# Altium schematic sheet Main_8.SchDoc
size 199 x 260 mm; SheetNumber: 11; SheetTotal: 12
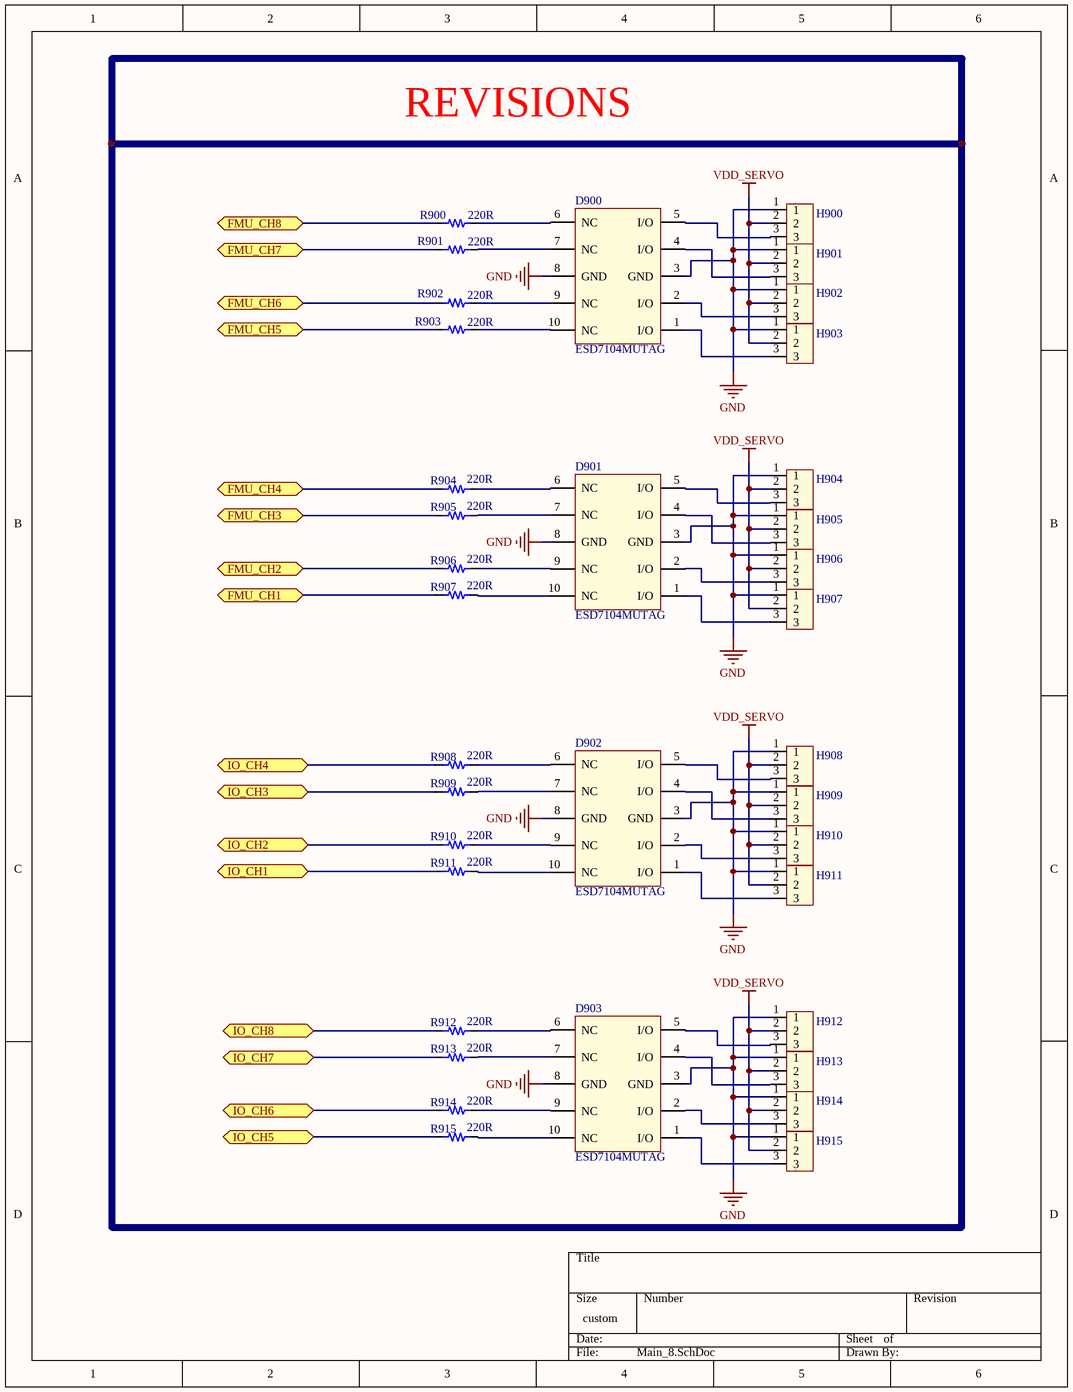
[diagram p0: Main_8.SchDoc]

## Parts
D900  ESD7104MUTAG  [UDFN10 2.5x1, 0.5P]
D901  ESD7104MUTAG  [UDFN10 2.5x1, 0.5P]
D902  ESD7104MUTAG  [UDFN10 2.5x1, 0.5P]
D903  ESD7104MUTAG  [UDFN10 2.5x1, 0.5P]
H900  Header 3x1  [Header 3x1]  (value not drawn)
H901  Header 3x1  [Header 3x1]  (value not drawn)
H902  Header 3x1  [Header 3x1]  (value not drawn)
H903  Header 3x1  [Header 3x1]  (value not drawn)
H904  Header 3x1  [Header 3x1]  (value not drawn)
H905  Header 3x1  [Header 3x1]  (value not drawn)
H906  Header 3x1  [Header 3x1]  (value not drawn)
H907  Header 3x1  [Header 3x1]  (value not drawn)
H908  Header 3x1  [Header 3x1]  (value not drawn)
H909  Header 3x1  [Header 3x1]  (value not drawn)
H910  Header 3x1  [Header 3x1]  (value not drawn)
H911  Header 3x1  [Header 3x1]  (value not drawn)
H912  Header 3x1  [Header 3x1]  (value not drawn)
H913  Header 3x1  [Header 3x1]  (value not drawn)
H914  Header 3x1  [Header 3x1]  (value not drawn)
H915  Header 3x1  [Header 3x1]  (value not drawn)
R900  220R  [R0402]
R901  220R  [R0402]
R902  220R  [R0402]
R903  220R  [R0402]
R904  220R  [R0402]
R905  220R  [R0402]
R906  220R  [R0402]
R907  220R  [R0402]
R908  220R  [R0402]
R909  220R  [R0402]
R910  220R  [R0402]
R911  220R  [R0402]
R912  220R  [R0402]
R913  220R  [R0402]
R914  220R  [R0402]
R915  220R  [R0402]

## Ports
FMU_CH1 (bidir), FMU_CH2 (bidir), FMU_CH3 (bidir), FMU_CH4 (bidir), FMU_CH5 (bidir), FMU_CH6 (bidir), FMU_CH7 (bidir), FMU_CH8 (bidir), IO_CH1 (bidir), IO_CH2 (bidir), IO_CH3 (bidir), IO_CH4 (bidir), IO_CH5 (bidir), IO_CH6 (bidir), IO_CH7 (bidir), IO_CH8 (bidir)

## Nets
GND: D900.3(GND) D900.8(GND) D901.3(GND) D901.8(GND) D902.3(GND) D902.8(GND) D903.3(GND) D903.8(GND) H900.1 H901.1 H902.1 H903.1 H904.1 H905.1 H906.1 H907.1 H908.1 H909.1 H910.1 H911.1 H912.1 H913.1 H914.1 H915.1
VDD_SERVO: H900.2 H901.2 H902.2 H903.2 H904.2 H905.2 H906.2 H907.2 H908.2 H909.2 H910.2 H911.2 H912.2 H913.2 H914.2 H915.2
FMU_CH1: R907.1 ; port FMU_CH1
FMU_CH2: R906.1 ; port FMU_CH2
FMU_CH3: R905.1 ; port FMU_CH3
FMU_CH4: R904.1 ; port FMU_CH4
FMU_CH5: R903.1 ; port FMU_CH5
FMU_CH6: R902.1 ; port FMU_CH6
FMU_CH7: R901.1 ; port FMU_CH7
FMU_CH8: R900.1 ; port FMU_CH8
IO_CH1: R911.1 ; port IO_CH1
IO_CH2: R910.1 ; port IO_CH2
IO_CH3: R909.1 ; port IO_CH3
IO_CH4: R908.1 ; port IO_CH4
IO_CH5: R915.1 ; port IO_CH5
IO_CH6: R914.1 ; port IO_CH6
IO_CH7: R913.1 ; port IO_CH7
IO_CH8: R912.1 ; port IO_CH8
NetD900_1: D900.1(I/O) H903.3
NetD900_2: D900.2(I/O) H902.3
NetD900_4: D900.4(I/O) H901.3
NetD900_5: D900.5(I/O) H900.3
NetD900_6: D900.6(NC) R900.2
NetD900_7: D900.7(NC) R901.2
NetD900_9: D900.9(NC) R902.2
NetD900_10: D900.10(NC) R903.2
NetD901_1: D901.1(I/O) H907.3
NetD901_2: D901.2(I/O) H906.3
NetD901_4: D901.4(I/O) H905.3
NetD901_5: D901.5(I/O) H904.3
NetD901_6: D901.6(NC) R904.2
NetD901_7: D901.7(NC) R905.2
NetD901_9: D901.9(NC) R906.2
NetD901_10: D901.10(NC) R907.2
NetD902_1: D902.1(I/O) H911.3
NetD902_2: D902.2(I/O) H910.3
NetD902_4: D902.4(I/O) H909.3
NetD902_5: D902.5(I/O) H908.3
NetD902_6: D902.6(NC) R908.2
NetD902_7: D902.7(NC) R909.2
NetD902_9: D902.9(NC) R910.2
NetD902_10: D902.10(NC) R911.2
NetD903_1: D903.1(I/O) H915.3
NetD903_2: D903.2(I/O) H914.3
NetD903_4: D903.4(I/O) H913.3
NetD903_5: D903.5(I/O) H912.3
NetD903_6: D903.6(NC) R912.2
NetD903_7: D903.7(NC) R913.2
NetD903_9: D903.9(NC) R914.2
NetD903_10: D903.10(NC) R915.2

## Notes on the sheet
- REVISIONS

## Library data of the parts
D900-D903 = ESD7104MUTAG: TVS DIODE 5VWM 10VC 10UDFN
R900-R915 = RC0402FR-07220RL: RES 220 OHM 1% 1/16W 0402